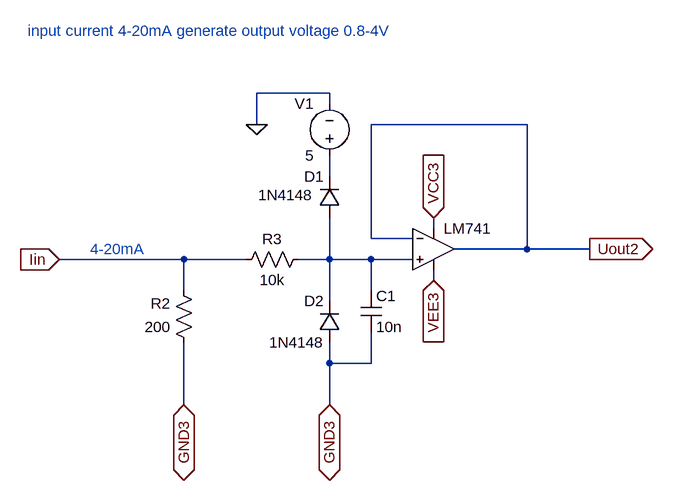
[diagram p0: schematic receiver.asc]
receiver.asc, the LTspice schematic file:
Version 4.1
SHEET 1 904 680
WIRE -768 -832 -880 -832
WIRE -768 -816 -768 -832
WIRE -880 -784 -880 -832
WIRE -464 -784 -704 -784
WIRE -768 -704 -768 -736
WIRE -608 -624 -608 -640
WIRE -704 -608 -704 -784
WIRE -640 -608 -704 -608
WIRE -464 -592 -464 -784
WIRE -464 -592 -576 -592
WIRE -368 -592 -464 -592
WIRE -992 -576 -1184 -576
WIRE -896 -576 -992 -576
WIRE -768 -576 -768 -640
WIRE -768 -576 -816 -576
WIRE -704 -576 -768 -576
WIRE -640 -576 -704 -576
WIRE -608 -544 -608 -560
WIRE -992 -528 -992 -576
WIRE -704 -528 -704 -576
WIRE -768 -512 -768 -576
WIRE -768 -416 -768 -448
WIRE -704 -416 -704 -464
WIRE -704 -416 -768 -416
WIRE -992 -352 -992 -448
WIRE -768 -352 -768 -416
FLAG -608 -640 VCC3
IOPIN -608 -640 In
FLAG -608 -544 VEE3
IOPIN -608 -544 In
FLAG -1184 -576 Iin
IOPIN -1184 -576 In
FLAG -368 -592 Uout2
IOPIN -368 -592 Out
FLAG -768 -352 GND3
IOPIN -768 -352 BiDir
FLAG -992 -352 GND3
IOPIN -992 -352 BiDir
FLAG -880 -784 0
SYMBOL OpAmps\\UniversalOpAmp -608 -592 R0
SYMATTR InstName LM741
SYMBOL res -976 -432 R180
WINDOW 0 36 76 Left 2
WINDOW 3 36 40 Left 2
SYMATTR InstName R2
SYMATTR Value 200
SYMBOL res -912 -560 R270
WINDOW 0 32 56 VTop 2
WINDOW 3 0 56 VBottom 2
SYMATTR InstName R3
SYMATTR Value 10k
SYMBOL diode -752 -448 R180
WINDOW 0 24 64 Left 2
WINDOW 3 24 0 Left 2
SYMATTR InstName D2
SYMATTR Value 1N4148
SYMBOL diode -752 -640 R180
WINDOW 0 24 64 Left 2
WINDOW 3 41 35 Left 2
SYMATTR InstName D1
SYMATTR Value 1N4148
SYMBOL cap -720 -528 R0
SYMATTR InstName C1
SYMATTR Value 10n
SYMBOL voltage -768 -720 R180
WINDOW 0 24 96 Left 2
WINDOW 3 24 16 Left 2
WINDOW 123 0 0 Left 0
WINDOW 39 0 0 Left 0
SYMATTR InstName V1
SYMATTR Value 5
TEXT -1136 -592 Left 2 ;4-20mA
TEXT -1232 -928 Left 2 ;input current 4-20mA generate output voltage 0.8-4V

The netlist it stands for:
* receiver.asc
X§LM741 N002 Uout2 VCC3 VEE3 Uout2 level1 Avol=1Meg GBW=10Meg Vos=0 En=0 Enk=0 In=0 Ink=0 Rin=500Meg  ; pins In+ In- V+ V- OUT
R2 GND3 Iin 200
R3 Iin N002 10k
D2 GND3 N002 1N4148
D1 N002 N001 1N4148
C1 N002 GND3 10n
V1 N001 0 5
.model D D
.lib standard.dio
* 4-20mA
* input current 4-20mA generate output voltage 0.8-4V
.lib UniversalOpAmp1.lib
.backanno
.end